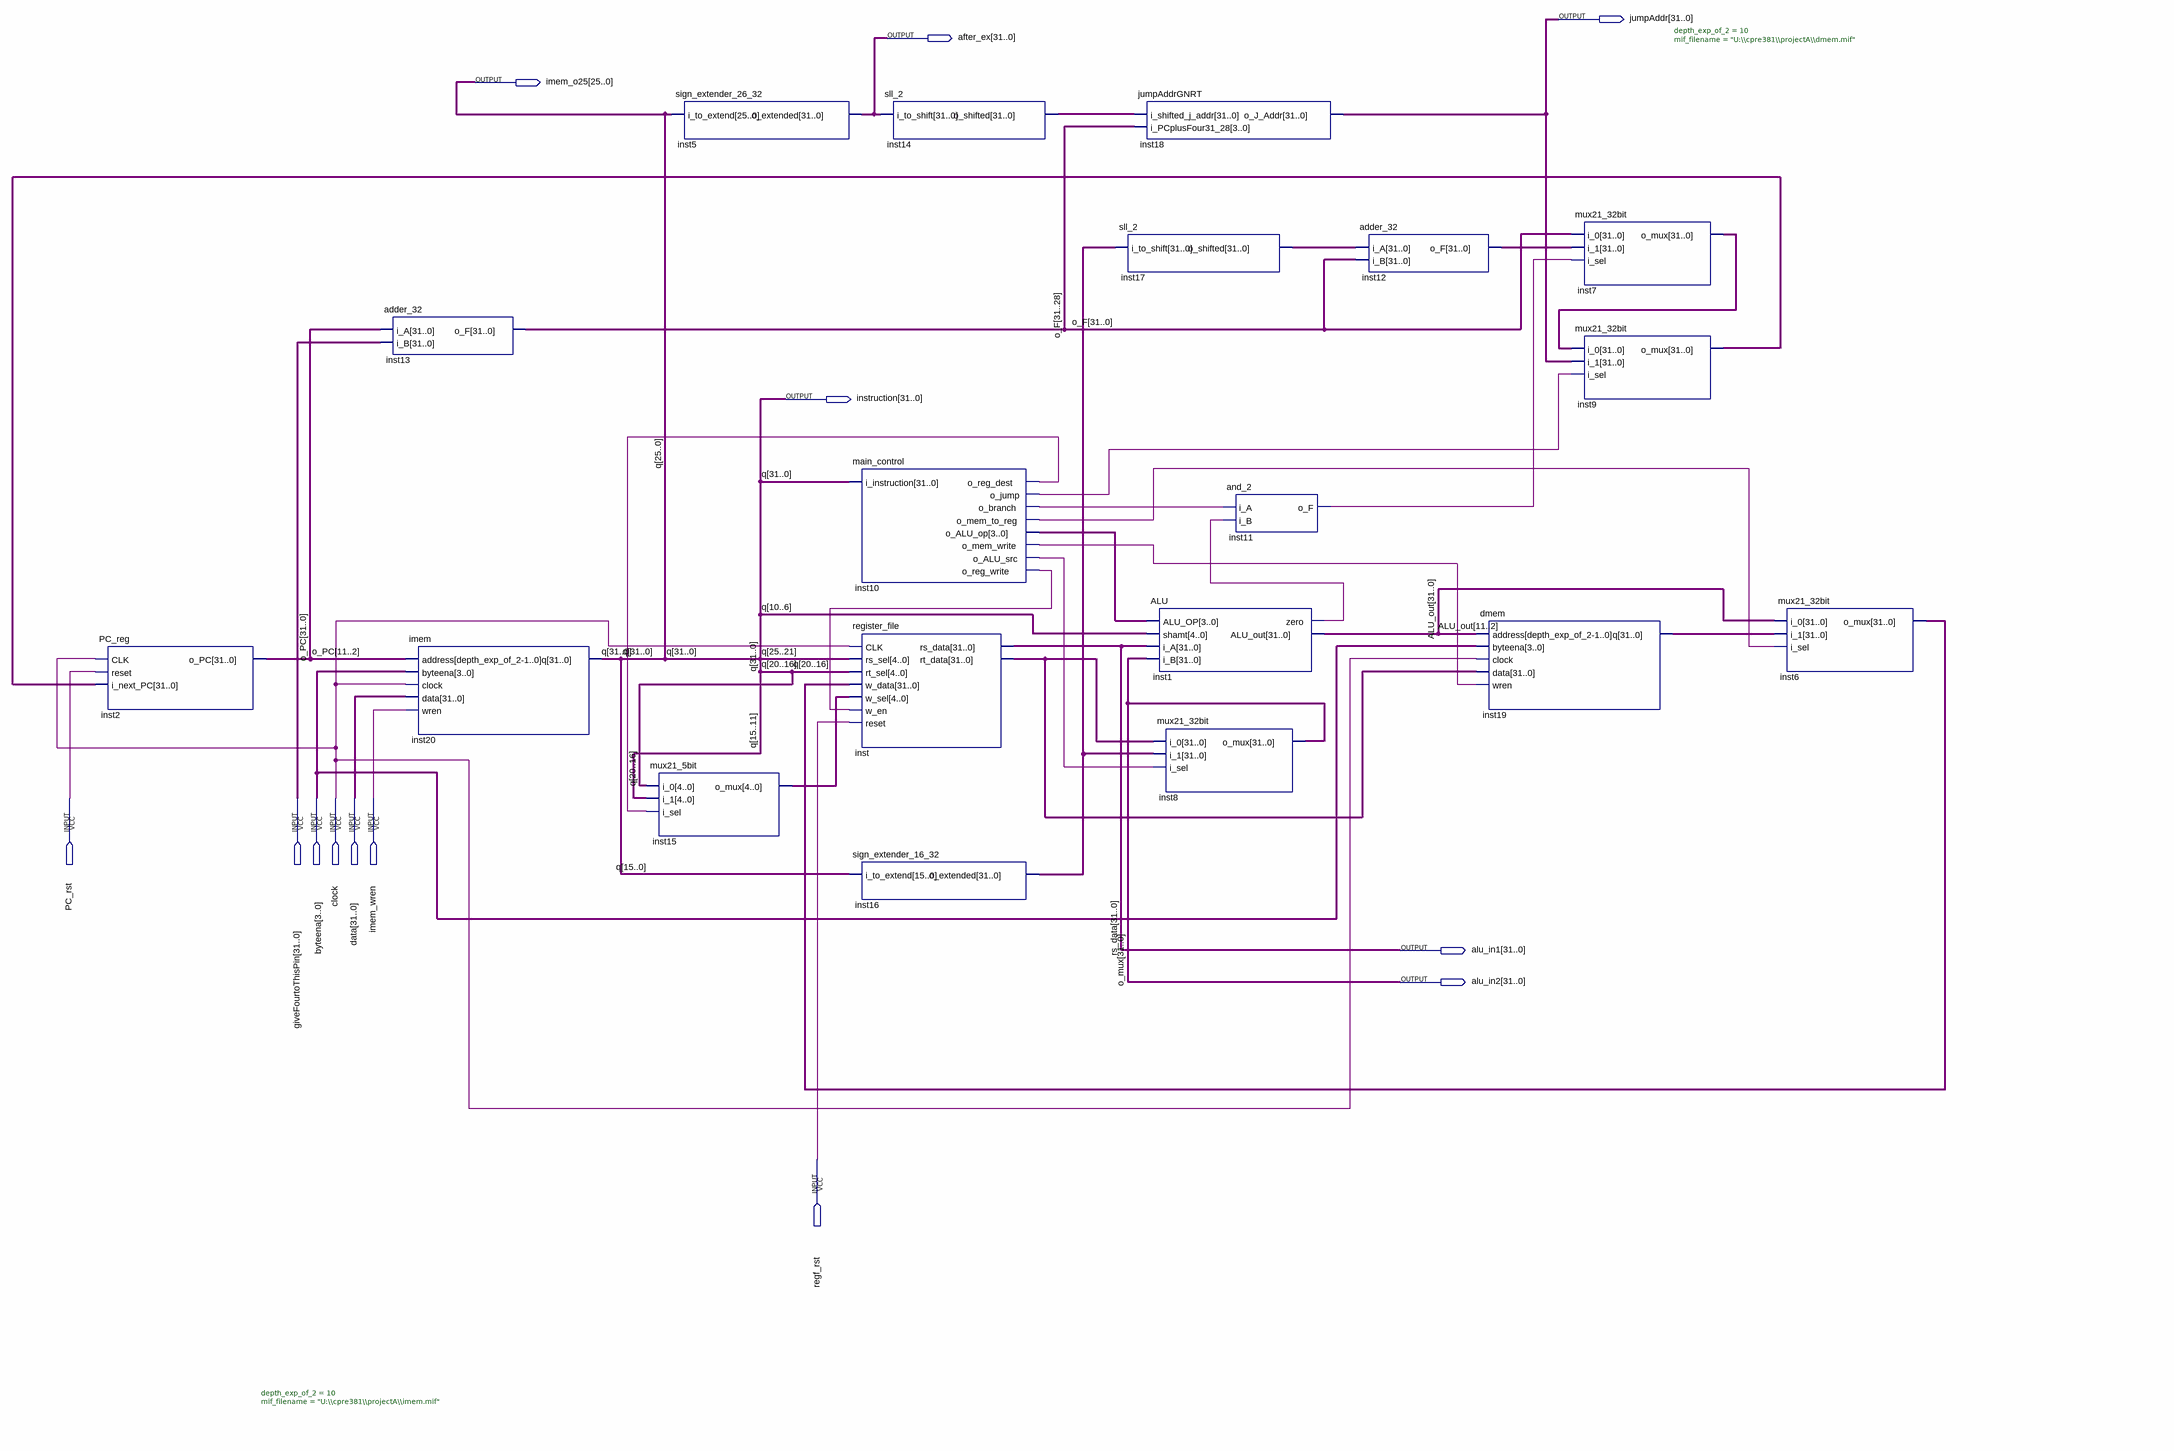
[diagram p0: schematic sheet]
// Quartus schematic projectA.bdf as structural Verilog: 19 symbols, 13 pins
module projectA (
  input  PC_rst,
  input  [31:0] giveFourtoThisPin,
  input  [3:0] byteena,
  input  clock,
  input  [31:0] data,
  input  imem_wren,
  input  regf_rst,
  output [31:0] jumpAddr,
  output [31:0] after_ex,
  output [25:0] imem_o25,
  output [31:0] instruction,
  output [31:0] alu_in1,
  output [31:0] alu_in2
);

  wire inst1_zero, inst10_o_alu_src, inst10_o_branch, inst10_o_jump, inst10_o_mem_to_reg, inst10_o_mem_write,
       inst10_o_reg_dest, inst10_o_reg_write, inst11_o_f;
  wire [3:0] inst10_o_alu_op;
  wire [4:0] inst15_o_mux;
  wire [31:0] ALU_out, inst6_o_mux, inst7_o_mux, inst9_o_mux, inst12_o_f, inst14_o_shifted,
       inst16_o_extended, inst17_o_shifted, inst19_q, inst_rt_data, o_F, o_PC;

  PC_reg inst2 (.CLK(clock), .reset(PC_rst), .i_next_PC(inst9_o_mux), .o_PC(o_PC));
  adder_32 inst13 (.i_A(o_PC), .i_B(giveFourtoThisPin), .o_F(o_F));
  imem #(.depth_exp_of_2(10), .mif_filename("U:\\cpre381\\projectA\\imem.mif")) inst20 (
    .address(o_PC[11:2]), .byteena(byteena), .clock(clock), .data(data), .wren(imem_wren),
    .q({instruction[31:26], imem_o25}));
  sign_extender_26_32 inst5 (.i_to_extend(imem_o25), .o_extended(after_ex));
  mux21_5bit inst15 (.i_0(imem_o25[20:16]), .i_1(imem_o25[15:11]), .i_sel(inst10_o_reg_dest), .o_mux(inst15_o_mux));
  sll_2 inst14 (.i_to_shift(after_ex), .o_shifted(inst14_o_shifted));
  main_control inst10 (
    .i_instruction({instruction[31:26], imem_o25}), .o_reg_dest(inst10_o_reg_dest), .o_jump(inst10_o_jump),
    .o_branch(inst10_o_branch), .o_mem_to_reg(inst10_o_mem_to_reg), .o_ALU_op(inst10_o_alu_op),
    .o_mem_write(inst10_o_mem_write), .o_ALU_src(inst10_o_alu_src), .o_reg_write(inst10_o_reg_write));
  register_file inst (
    .CLK(clock), .rs_sel(imem_o25[25:21]), .rt_sel(imem_o25[20:16]), .w_data(inst6_o_mux),
    .w_sel(inst15_o_mux), .w_en(inst10_o_reg_write), .reset(regf_rst), .rs_data(alu_in1),
    .rt_data(inst_rt_data));
  sign_extender_16_32 inst16 (.i_to_extend(imem_o25[15:0]), .o_extended(inst16_o_extended));
  jumpAddrGNRT inst18 (.i_shifted_j_addr(inst14_o_shifted), .i_PCplusFour31_28(o_F[31:28]), .o_J_Addr(jumpAddr));
  sll_2 inst17 (.i_to_shift(inst16_o_extended), .o_shifted(inst17_o_shifted));
  ALU inst1 (
    .ALU_OP(inst10_o_alu_op), .shamt(imem_o25[10:6]), .i_A(alu_in1), .i_B(alu_in2), .zero(inst1_zero),
    .ALU_out(ALU_out));
  mux21_32bit inst8 (.i_0(inst_rt_data), .i_1(inst16_o_extended), .i_sel(inst10_o_alu_src), .o_mux(alu_in2));
  and_2 inst11 (.i_A(inst10_o_branch), .i_B(inst1_zero), .o_F(inst11_o_f));
  adder_32 inst12 (.i_A(inst17_o_shifted), .i_B(o_F), .o_F(inst12_o_f));
  dmem #(.depth_exp_of_2(10), .mif_filename("U:\\cpre381\\projectA\\dmem.mif")) inst19 (
    .address(ALU_out[11:2]), .byteena(byteena), .clock(clock), .data(inst_rt_data),
    .wren(inst10_o_mem_write), .q(inst19_q));
  mux21_32bit inst7 (.i_0(o_F), .i_1(inst12_o_f), .i_sel(inst11_o_f), .o_mux(inst7_o_mux));
  mux21_32bit inst9 (.i_0(inst7_o_mux), .i_1(jumpAddr), .i_sel(inst10_o_jump), .o_mux(inst9_o_mux));
  mux21_32bit inst6 (.i_0(ALU_out), .i_1(inst19_q), .i_sel(inst10_o_mem_to_reg), .o_mux(inst6_o_mux));

  assign instruction[25:0] = imem_o25;

  // Other names for the same wires on the sheet: rs_data[31:0] = alu_in1; o_mux[31:0] = alu_in2;
  //   q[31:0] = {instruction[31:26], imem_o25}
endmodule
